# EAGLE design 5VAC-DCRegulator (EAGLE 9.6.2)
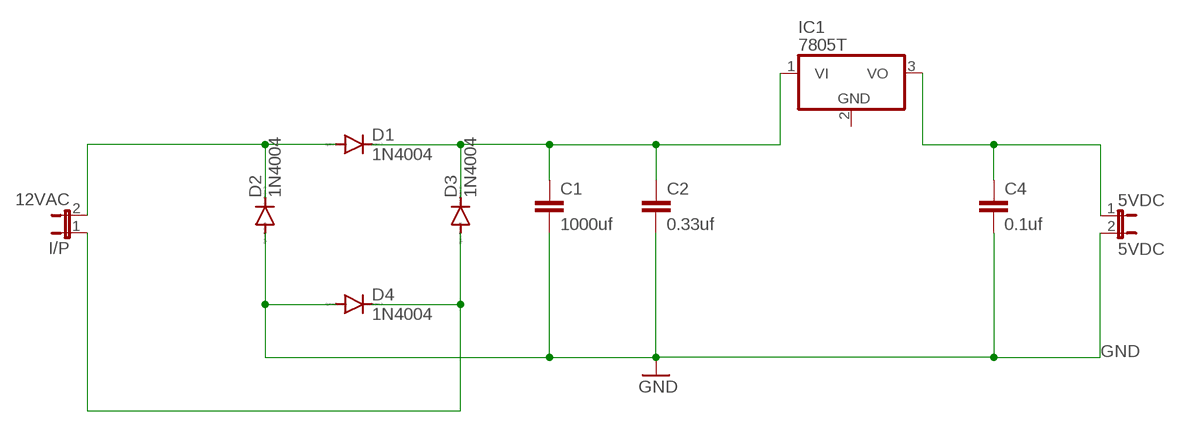
[diagram p0: schematic, sheet 1]

## Parts
5VDC  5VDC  JP1E  [JP1]
C1  1000uf  C2,5-3  [C2.5-3]
C2  0.33uf  C2,5-3  [C2.5-3]
C4  0.1uf  C2,5-3  [C2.5-3]
D1  1N4004  [DO41-10]
D2  1N4004  [DO41-10]
D3  1N4004  [DO41-10]
D4  1N4004  [DO41-10]
I/P  12VAC  JP1E  [JP1]
IC1  7805T  [TO220H]

## Nets
GND: 5VDC.2 C1.2 C2.2 C4.2 D2.A D4.A
N$1: D1.A D2.C I/P.2
N$3: C1.1 C2.1 D1.C D3.C IC1.1(VI)
N$4: D3.A D4.C I/P.1
N$5: 5VDC.1 C4.1 IC1.3(VO)
Unconnected: IC1.2(GND)

## Library data of the parts
5VDC I/P = jumper:JP1E: JUMPER
C1 C2 C4 = capacitor-wima:C: CAPACITOR naming: grid - package width
D1-D4 = diode:1N4004: DIODE general purpose rectifier, 1 A
IC1 = linear:78*: Positive VOLTAGE REGULATOR Source: http://cache.national.com/ds/LM/LM78L05.pdf http://www.fairchildsemi.com/ds/LM/LM7805.pdf

## Board
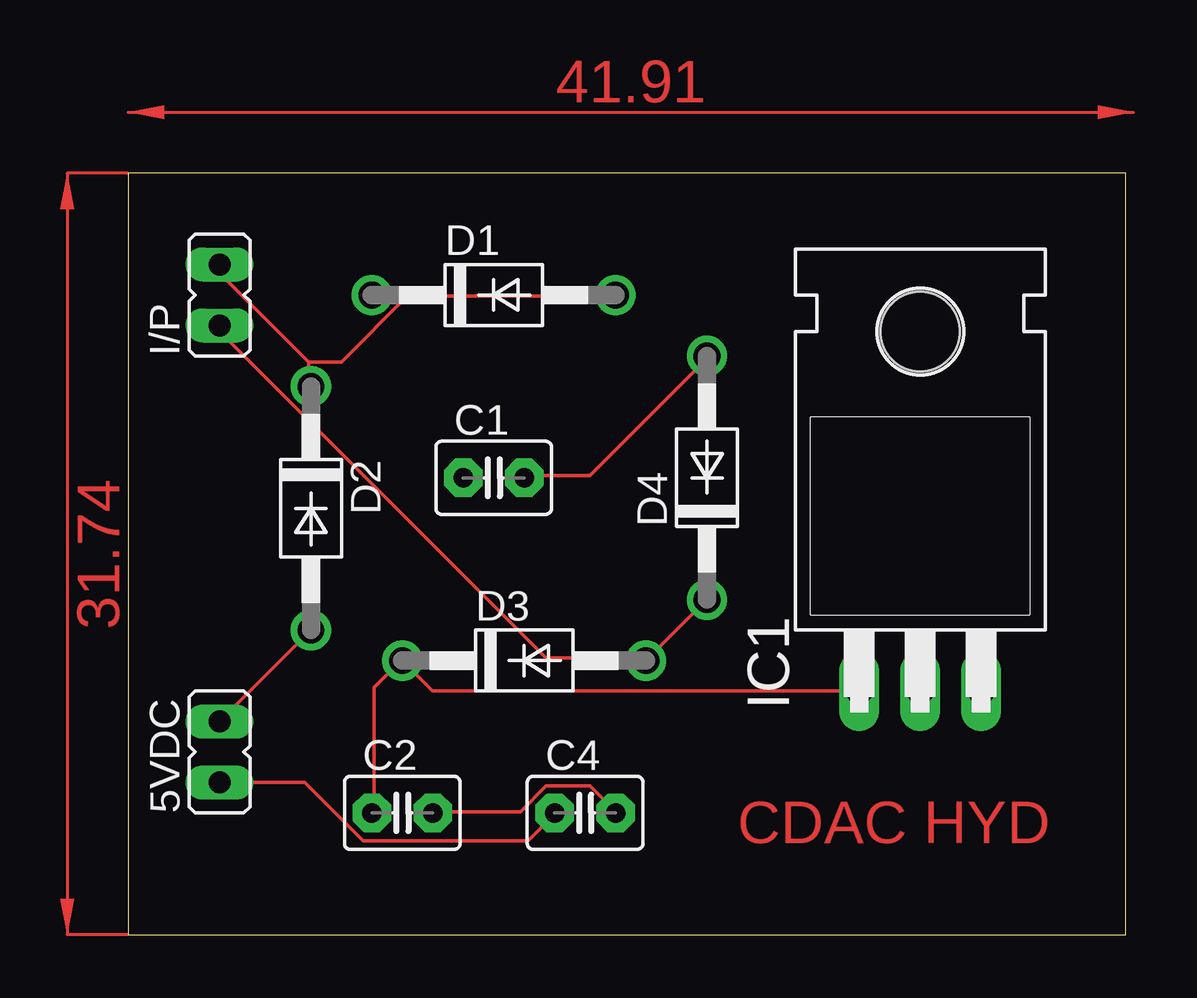
[diagram p1: board, top side]
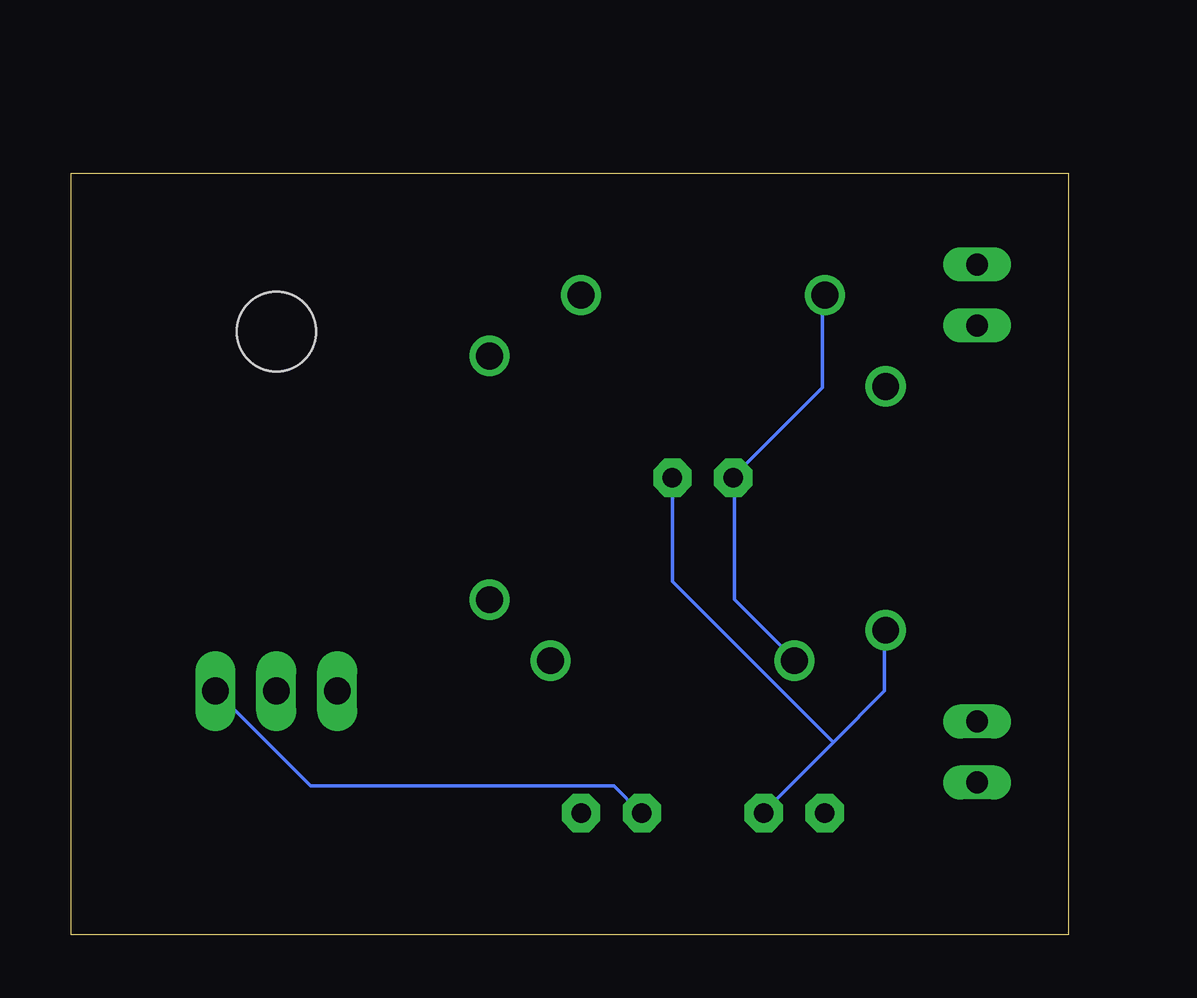
[diagram p2: board, bottom side, seen from below]

Size 41.58 x 31.74 mm. Coordinates in mm from the lower left corner, seen from the top.
Outline: 0,0 41.58,0 41.58,31.74 0,31.74 0,0
Copper layers (1*16): Top 0.035mm / dielectric 1.5mm / Bottom 0.035mm
Design rules "default": minimum track width 6mil, minimum drill 0.35mm, track to track 6mil, track to pad 6mil, pad to pad 6mil, via to via 6mil, smd to smd 6mil, copper to edge 40mil, drill to drill 6mil, minimum pad ring 10mil, minimum via ring 8mil, stop-mask expansion 4mil, vias tented up to drill 0mil, thermal gap 10mil

### Footprints (pad centres in the part's own frame; a part is rotated, then mirrored left to right if it is on the bottom)
JP1 = drill 0.914 long: 1 0,-1.27; 2 0,1.27
C2.5-3 = drill 0.813 pad 1.6 octagon: 1 -1.27,0; 2 1.27,0
DO41-10 = drill 1.118: A 5.08,0; C -5.08,0
TO220H = drill 1.118 long: 1 -2.54,-10.16; 2 0,-10.16; 3 2.54,-10.16 | hole 3.302: 0,4.826

### Placement (x,y rotation side)
5VDC  3.81,7.62 0 top
C1  15.24,19.05 0 top
C2  11.43,5.08 0 top
C4  19.05,5.08 0 top
D1  15.24,26.67 0 top
D2  7.62,17.78 270 top
D3  16.51,11.43 0 top
D4  24.13,19.05 90 top
I/P  3.81,26.67 0 top
IC1  33.02,20.32 0 top

### Tracks (layer width: path | path; a pad name or v marks a point on that pad's centre or on a via)
GND
  Top 0.152: C1.2 16.51,19.15 19.25,19.15 24.13,24.03 D4.A | D2.A 5VDC.2 | C2.2 12.7,5.13 16.36,5.13 17.42,6.2 19.25,6.2 20.32,5.13 C4.2
  Bottom 0.152: 9.8,8.03 12.7,5.13 C2.2 | 9.8,8.03 7.67,10.16 7.67,12.6 D2.A | C1.2 16.51,14.73 9.8,8.03
N$1
  Top 0.152: 7.52,23.88 3.86,27.53 3.86,27.84 I/P.2 | 7.52,23.88 7.52,22.96 D2.C | 7.52,23.88 8.89,23.88 11.63,26.62 20.32,26.62 D1.A
N$3
  Top 0.152: C2.1 10.26,5.13 10.26,10.31 11.33,11.38 D3.C 12.7,10.16 IC1.1
  Bottom 0.152: D3.C 11.48,11.53 13.92,13.97 13.92,19 C1.1 13.92,19.15 10.26,22.81 10.26,26.62 D1.C
N$4
  Top 0.152: I/P.1 3.86,25.4 3.86,25.09 17.42,11.53 21.54,11.53 D3.A D4.C
N$5
  Top 0.152: 5VDC.1 7.37,6.35 9.8,3.91 16.66,3.91 17.73,4.98 C4.1
  Bottom 0.152: IC1.3 31.6,6.2 18.95,6.2 17.88,5.13 C4.1
(copper drawn outside any net)
  shapes: Top area x2

### Text on the board
Top: CDAC HYD